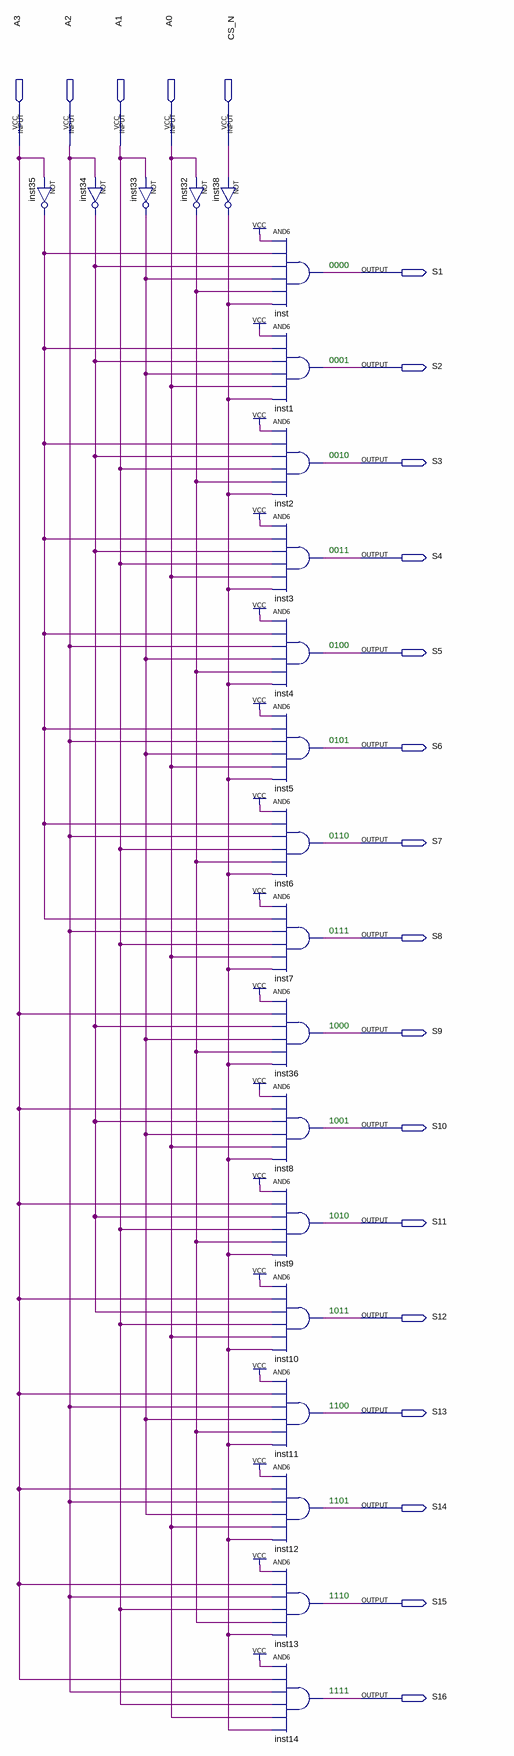
[diagram p0: schematic sheet]
// Quartus schematic CI74F189_Decordificador.bdf as structural Verilog: 21 symbols, 21 pins
module CI74F189_Decordificador (
  input  A3,
  input  A2,
  input  A1,
  input  A0,
  input  CS_N,
  output S1,
  output S2,
  output S3,
  output S4,
  output S5,
  output S6,
  output S7,
  output S8,
  output S9,
  output S10,
  output S11,
  output S12,
  output S13,
  output S14,
  output S15,
  output S16
);

  wire inst32_out, inst33_out, inst34_out, inst35_out, inst38_out;

  not inst35 (inst35_out, A3);
  not inst34 (inst34_out, A2);
  not inst33 (inst33_out, A1);
  not inst32 (inst32_out, A0);
  not inst38 (inst38_out, CS_N);
  and inst (S1, 1'b1, inst35_out, inst34_out, inst33_out, inst32_out, inst38_out);
  and inst1 (S2, 1'b1, inst35_out, inst34_out, inst33_out, A0, inst38_out);
  and inst2 (S3, 1'b1, inst35_out, inst34_out, A1, inst32_out, inst38_out);
  and inst3 (S4, 1'b1, inst35_out, inst34_out, A1, A0, inst38_out);
  and inst4 (S5, 1'b1, inst35_out, A2, inst33_out, inst32_out, inst38_out);
  and inst5 (S6, 1'b1, inst35_out, A2, inst33_out, A0, inst38_out);
  and inst6 (S7, 1'b1, inst35_out, A2, A1, inst32_out, inst38_out);
  and inst7 (S8, 1'b1, inst35_out, A2, A1, A0, inst38_out);
  and inst36 (S9, 1'b1, A3, inst34_out, inst33_out, inst32_out, inst38_out);
  and inst8 (S10, 1'b1, A3, inst34_out, inst33_out, A0, inst38_out);
  and inst9 (S11, 1'b1, A3, inst34_out, A1, inst32_out, inst38_out);
  and inst10 (S12, 1'b1, A3, inst34_out, A1, A0, inst38_out);
  and inst11 (S13, 1'b1, A3, A2, inst33_out, inst32_out, inst38_out);
  and inst12 (S14, 1'b1, A3, A2, inst33_out, A0, inst38_out);
  and inst13 (S15, 1'b1, A3, A2, A1, inst32_out, inst38_out);
  and inst14 (S16, 1'b1, A3, A2, A1, A0, inst38_out);

  // Notes on the sheet:
  //   0000
  //   0001
  //   0010
  //   0011
  //   0100
  //   0101
  //   0110
  //   0111
  //   1000
  //   1001
  //   1010
  //   1011
  //   1100
  //   1101
  //   1110
  //   1111
endmodule
